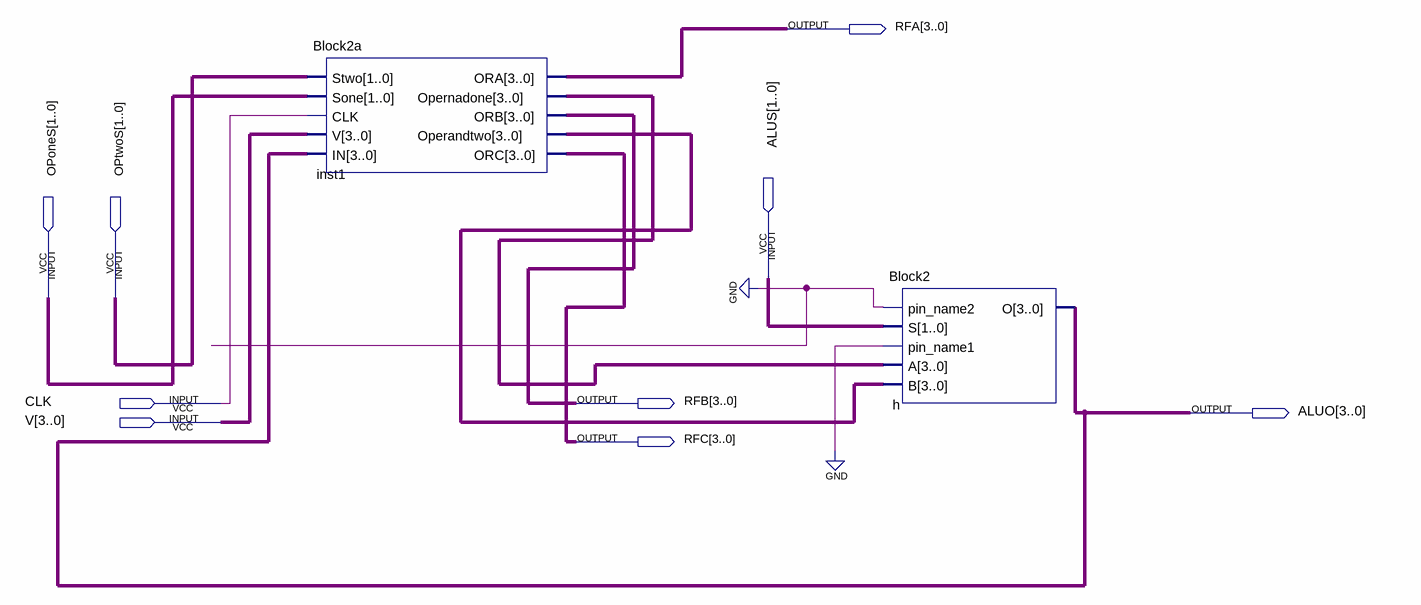
[diagram p0: schematic sheet]
// Quartus schematic Block5.bdf as structural Verilog: 2 symbols, 9 pins
module Block5 (
  input  [1:0] ALUS,
  input  [1:0] OPoneS,
  input  [1:0] OPtwoS,
  input  CLK,
  input  [3:0] V,
  output [3:0] RFA,
  output [3:0] RFB,
  output [3:0] ALUO,
  output [3:0] RFC
);

  wire [3:0] inst1_operandtwo, inst1_opernadone;

  Block2a inst1 (
    .Stwo(OPtwoS), .Sone(OPoneS), .CLK(CLK), .V(V), .IN(ALUO), .ORA(RFA), .Opernadone(inst1_opernadone),
    .ORB(RFB), .Operandtwo(inst1_operandtwo), .ORC(RFC));
  Block2 h (.pin_name2(1'b0), .S(ALUS), .pin_name1(1'b0), .A(inst1_opernadone), .B(inst1_operandtwo), .O(ALUO));
endmodule
